# Altium schematic sheet Test_Jig_Power.SchDoc
size A2; DrawnBy: Philip Rowse
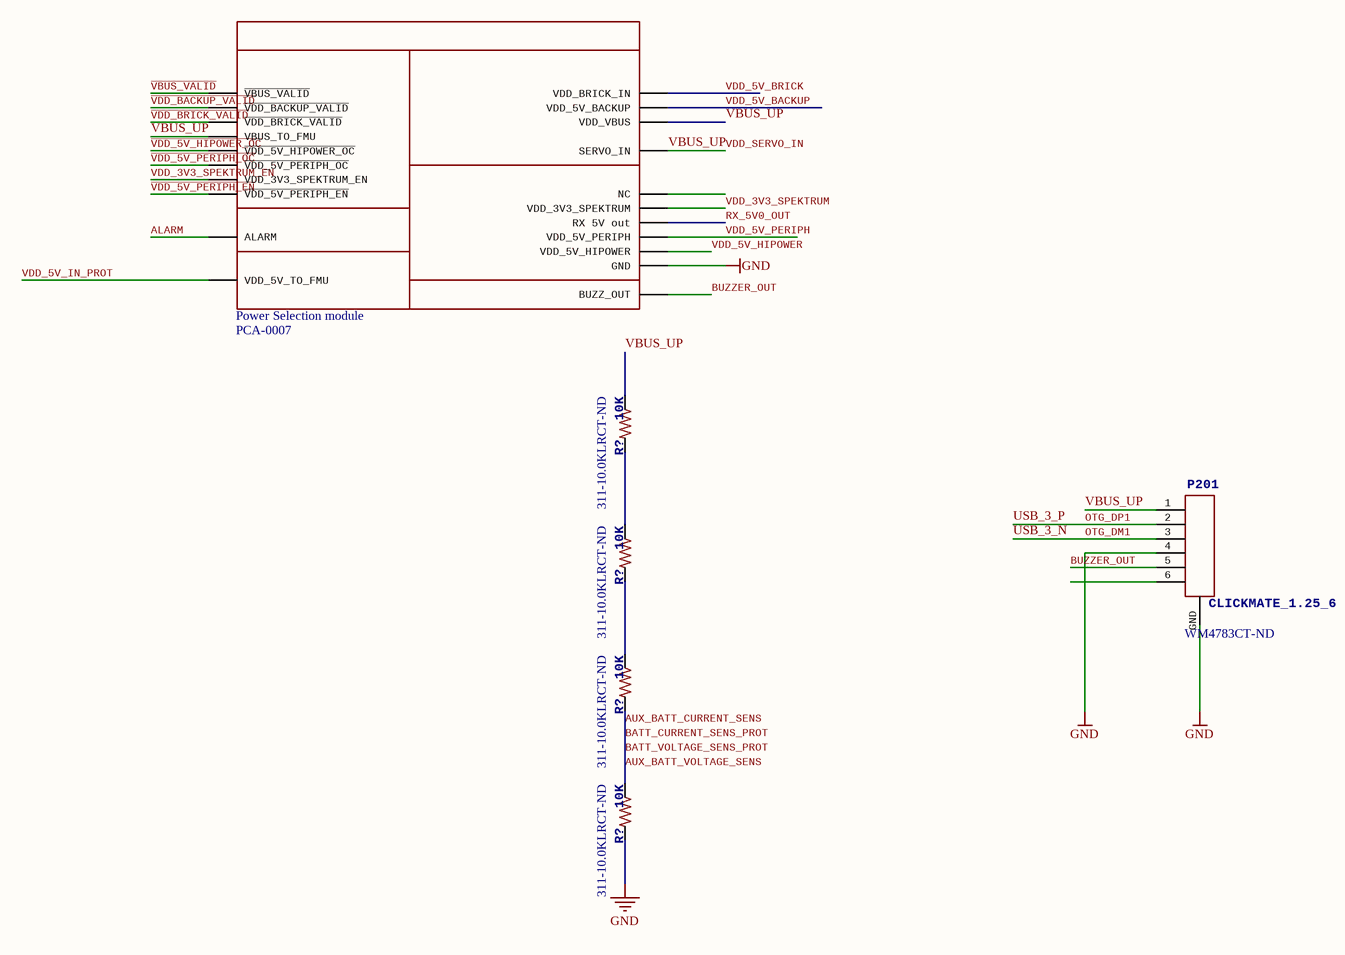
[diagram p0: Test_Jig_Power.SchDoc]

## Parts
(Parts that share a designator on the sheet are numbered #1, #2 ... from top to bottom, then left to right.)
P201  CLICKMATE_1.25_6  Supplier Part Number 1: WM4783CT-ND  [CLICKMATE_V6]
PSM200  Power Selection module  Supplier Part Number 1: PCA-0007  [PSM]
R?#1  10K  Supplier Part Number 1: 311-10.0KLRCT-ND  [0402-RES]
R?#2  10K  Supplier Part Number 1: 311-10.0KLRCT-ND  [0402-RES]
R?#3  10K  Supplier Part Number 1: 311-10.0KLRCT-ND  [0402-RES]
R?#4  10K  Supplier Part Number 1: 311-10.0KLRCT-ND  [0402-RES]

## Nets
GND: P201.4 P201.GND PSM200.GND R?#4.P$2
ALARM: PSM200.ALARM
AUX_BATT_CURRENT_SENS: R?#3.P$2 R?#4.P$1  [also labelled AUX_BATT_VOLTAGE_SENS, BATT_CURRENT_SENS_PROT, BATT_VOLTAGE_SENS_PROT]
BUZZER_OUT: P201.5 PSM200.BUZZER_OUT(BUZZ_OUT)
OTG_DM1: P201.3  [also labelled USB_3_N]
OTG_DP1: P201.2  [also labelled USB_3_P]
RX_5V0_OUT: PSM200.RX(RX_5V_out)
~{VBUS_VALID}: PSM200.!VBUS_VALID(~{VBUS_VALID})
~{VDD_5V_HIPOWER_OC}: PSM200.!VDD_5V_HIPOWER_OC(~{VDD_5V_HIPOWER_OC})
~{VDD_5V_PERIPH_EN}: PSM200.!VDD_5V_PERIPH_EN(~{VDD_5V_PERIPH_EN})
~{VDD_5V_PERIPH_OC}: PSM200.!VDD_5V_PERIPH_OC(~{VDD_5V_PERIPH_OC})
~{VDD_BACKUP_VALID}: PSM200.!VDD_BACKUP_VALID(~{VDD_BACKUP_VALID})
~{VDD_BRICK_VALID}: PSM200.!VDD_BRICK_VALID(~{VDD_BRICK_VALID})
VBUS_UP: P201.1 PSM200.SERVO_IN PSM200.VBUS(VBUS_TO_FMU) PSM200.VDD_VBUS R?#1.P$1  [also labelled VDD_SERVO_IN]
VDD_3V3_SPEKTRUM: PSM200.SPEK(VDD_3V3_SPEKTRUM)
VDD_3V3_SPEKTRUM_EN: PSM200.VDD_3V3_SPEKTRUM_EN
VDD_5V_BACKUP: PSM200.VDD_5V_BACKUP
VDD_5V_BRICK: PSM200.VDD_BRICK_IN
VDD_5V_HIPOWER: PSM200.5V_HIPOWER(VDD_5V_HIPOWER)
VDD_5V_IN_PROT: PSM200.VDD_5V_IN_PROT(VDD_5V_TO_FMU)
VDD_5V_PERIPH: PSM200.5V_PERIPH(VDD_5V_PERIPH)
NetR?#1_P$2: R?#1.P$2 R?#2.P$1
NetR?#2_P$2: R?#2.P$2 R?#3.P$1

Not connected (* = marked no-connect by the designer): P201 6; PSM200 NC

## Notes on the sheet
- Title
- Size:
- Date:
- File:
- A2
- Number:
- Time:
- Revision:
- Sheet
- of

## Library data of the parts
P201 = CLICKMATE_1.25_6: Connector, Rcpt, 6Pos, 1.25MM, W/B, VERT, SMD, Tin; 3DR_PARTNO: PRT0439; Supplier 1: Digi-Key
PSM200 = PSMPSM: PCA, PSM, PX4, Assembly; Manufacturer 1: 3DR; Mfg Part Num (Alternate): DO NOT SWAP; 3DR_PARTNO: PCA0007; Supplier 1: 3DR; Supplier Unit Price 1: 17; Manufacturer Part Number 1: PCA-0007; Supplier Currency 1: USD; Supplier Order Qty 1: 100
R?#1-R?#4 = RESISTOR0402-RES: RES 10K OHM 1/16W 1% 0402 SMD; PARTNO: RC0402FR-0710KL; 3DR_PARTNO: ECM0800; Supplier 1: Digi-Key; Value: 10K